# EAGLE schematic linear_current_regulator (EAGLE 6.4)
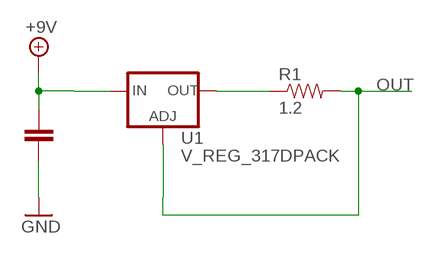
[diagram p0: schematic, sheet 1]

## Parts
C1  0.1uF  CAP0402-CAP  [0402-CAP]
R1  1.2  RESISTOR0402-RES  [0402-RES]
U1  V_REG_317DPACK  [V-REG_DPACK]

## Nets
+9V: C1.1 U1.3(IN)
GND: C1.2
N$1: R1.1 U1.4(OUT)
OUT: R1.2 U1.1(ADJ)

## Library data of the parts
C1 = SparkFun-Passives:CAP: Capacitor Standard 0603 ceramic capacitor, and 0.1" leaded capacitor.
R1 = SparkFun-Passives:RESISTOR: Resistor Basic schematic elements and footprints for 0603, 1206, and PTH resistors.
U1 = SparkFun-PowerIC:V_REG_317: Voltage Regulator Standard LM317 adjustable voltage regulator. AOI (Adjust Output Input). Google 'LM317 Calculator' for easy to use app to get the two resistor values needed. 240/720 for 5V output. 240/390 for 3.3V output. Spark Fun Electronics SKU : COM-00527